# EAGLE design Inyector_fibra_fusibles (EAGLE 9.6.2)
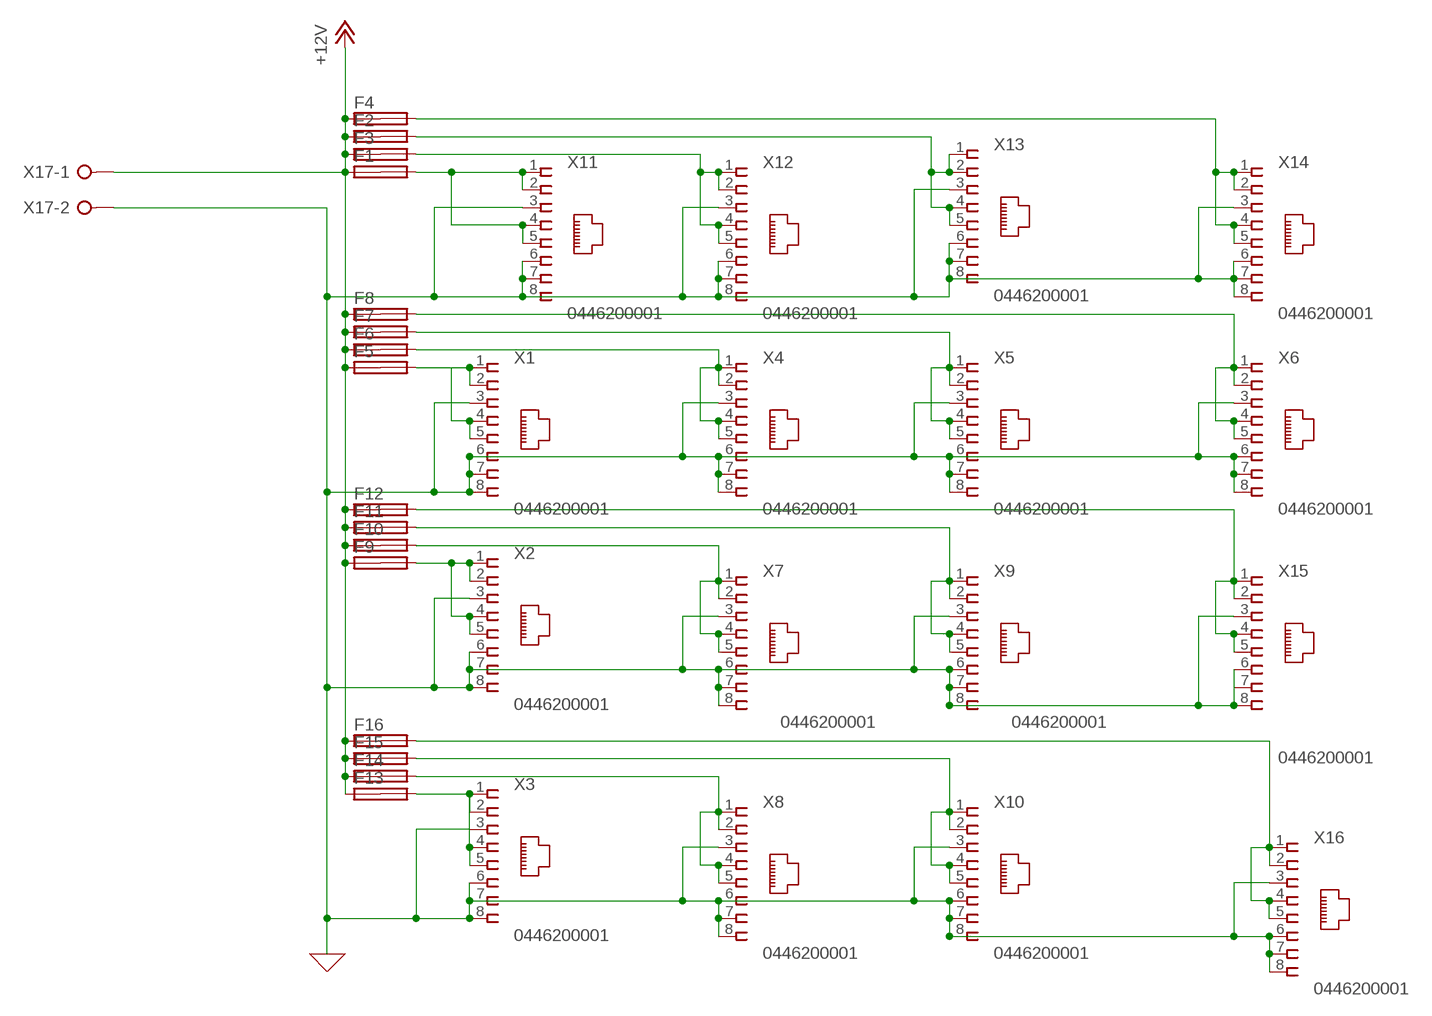
[diagram p0: schematic, sheet 1]

## Parts
F1  SHK20Q  [SHK20Q]
F2  SHK20Q  [SHK20Q]
F3  SHK20Q  [SHK20Q]
F4  SHK20Q  [SHK20Q]
F5  SHK20Q  [SHK20Q]
F6  SHK20Q  [SHK20Q]
F7  SHK20Q  [SHK20Q]
F8  SHK20Q  [SHK20Q]
F9  SHK20Q  [SHK20Q]
F10  SHK20Q  [SHK20Q]
F11  SHK20Q  [SHK20Q]
F12  SHK20Q  [SHK20Q]
F13  SHK20Q  [SHK20Q]
F14  SHK20Q  [SHK20Q]
F15  SHK20Q  [SHK20Q]
F16  SHK20Q  [SHK20Q]
X1  0446200001  [0446200001]
X2  0446200001  [0446200001]
X3  0446200001  [0446200001]
X4  0446200001  [0446200001]
X5  0446200001  [0446200001]
X6  0446200001  [0446200001]
X7  0446200001  [0446200001]
X8  0446200001  [0446200001]
X9  0446200001  [0446200001]
X10  0446200001  [0446200001]
X11  0446200001  [0446200001]
X12  0446200001  [0446200001]
X13  0446200001  [0446200001]
X14  0446200001  [0446200001]
X15  0446200001  [0446200001]
X16  0446200001  [0446200001]
X17  W237-02P  [W237-132]

## Nets
0: X1.3 X1.6 X1.7 X1.8 X2.3 X2.6 X2.7 X2.8 X3.3 X3.6 X3.7 X3.8 X4.3 X4.6 X4.7 X4.8 X5.3 X5.6 X5.7 X5.8 X6.3 X6.6 X6.7 X6.8 X7.3 X7.6 X7.7 X7.8 X8.3 X8.6 X8.7 X8.8 X9.3 X9.6 X9.7 X9.8 X10.3 X10.6 X10.7 X10.8 X11.3 X11.6 X11.7 X11.8 X12.3 X12.6 X12.7 X12.8 X13.3 X13.6 X13.7 X13.8 X14.3 X14.6 X14.7 X14.8 X15.3 X15.6 X15.7 X15.8 X16.3 X16.6 X16.7 X16.8 X17.2 ; supply symbol labelled GND
+12V: F1.1A F2.1A F3.1A F4.1A F5.1A F6.1A F7.1A F8.1A F9.1A F10.1A F11.1A F12.1A F13.1A F14.1A F15.1A F16.1A X17.1
N$1: F12.2A X15.1 X15.2 X15.4 X15.5
N$2: F6.2A X4.1 X4.2 X4.4 X4.5
N$3: F7.2A X5.1 X5.2 X5.4 X5.5
N$4: F1.2A X11.1 X11.2 X11.4 X11.5
N$5: F8.2A X6.1 X6.2 X6.4 X6.5
N$6: F3.2A X12.1 X12.2 X12.4 X12.5
N$7: F2.2A X13.1 X13.2 X13.4 X13.5
N$8: F4.2A X14.1 X14.2 X14.4 X14.5
N$9: F9.2A X2.1 X2.2 X2.4 X2.5
N$12: F5.2A X1.1 X1.2 X1.4 X1.5
N$16: F10.2A X7.1 X7.2 X7.4 X7.5
N$17: F11.2A X9.1 X9.2 X9.4 X9.5
N$18: F13.2A X3.1 X3.2 X3.4 X3.5
N$19: F16.2A X16.1 X16.2 X16.4 X16.5
N$22: F14.2A X8.1 X8.2 X8.4 X8.5
N$24: F15.2A X10.1 X10.2 X10.4 X10.5
Unconnected: F1.1B F1.2B F2.1B F2.2B F3.1B F3.2B F4.1B F4.2B F5.1B F5.2B F6.1B F6.2B F7.1B F7.2B F8.1B F8.2B F9.1B F9.2B F10.1B F10.2B F11.1B F11.2B F12.1B F12.2B F13.1B F13.2B F14.1B F14.2B F15.1B F15.2B F16.1B F16.2B

## Library data of the parts
F1-F16 = fuse:SHK20Q: FUSE HOLDER 5 x 20 mm, SH contact, E1207 Buerklin 64G6061; OC_FARNELL: unknown; OC_NEWARK: unknown
X1-X16 = con-molex:0446200001: RJ-45 INVERTED MODULAR JACK ASSEMBLY WITH RJ-11 KEEPOUT FEATURE Source: Data sheet <http://www.farnell.com/datasheets/73207.pdf>; MF: MOLEX; OC_FARNELL: unknown
X17 = con-wago-508:W237-02P: WAGO SREW CLAMP; OC_FARNELL: unknown; OC_NEWARK: unknown

## Board
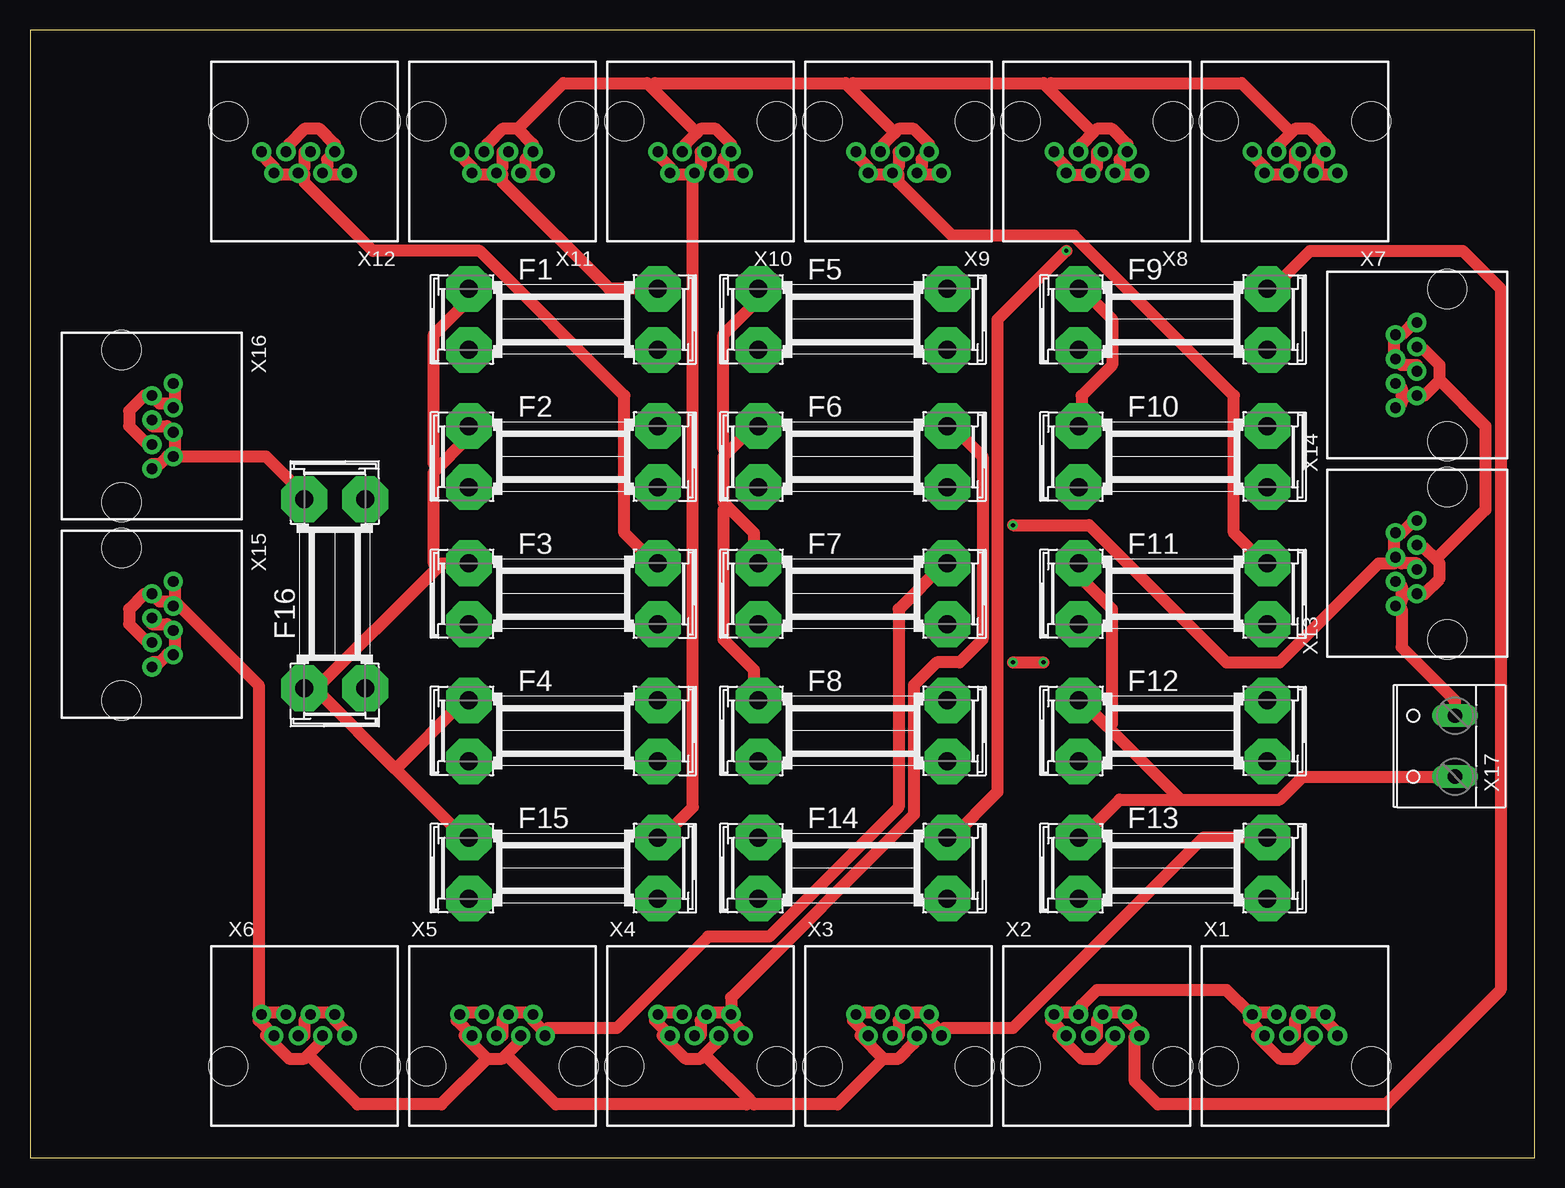
[diagram p1: board, top side]
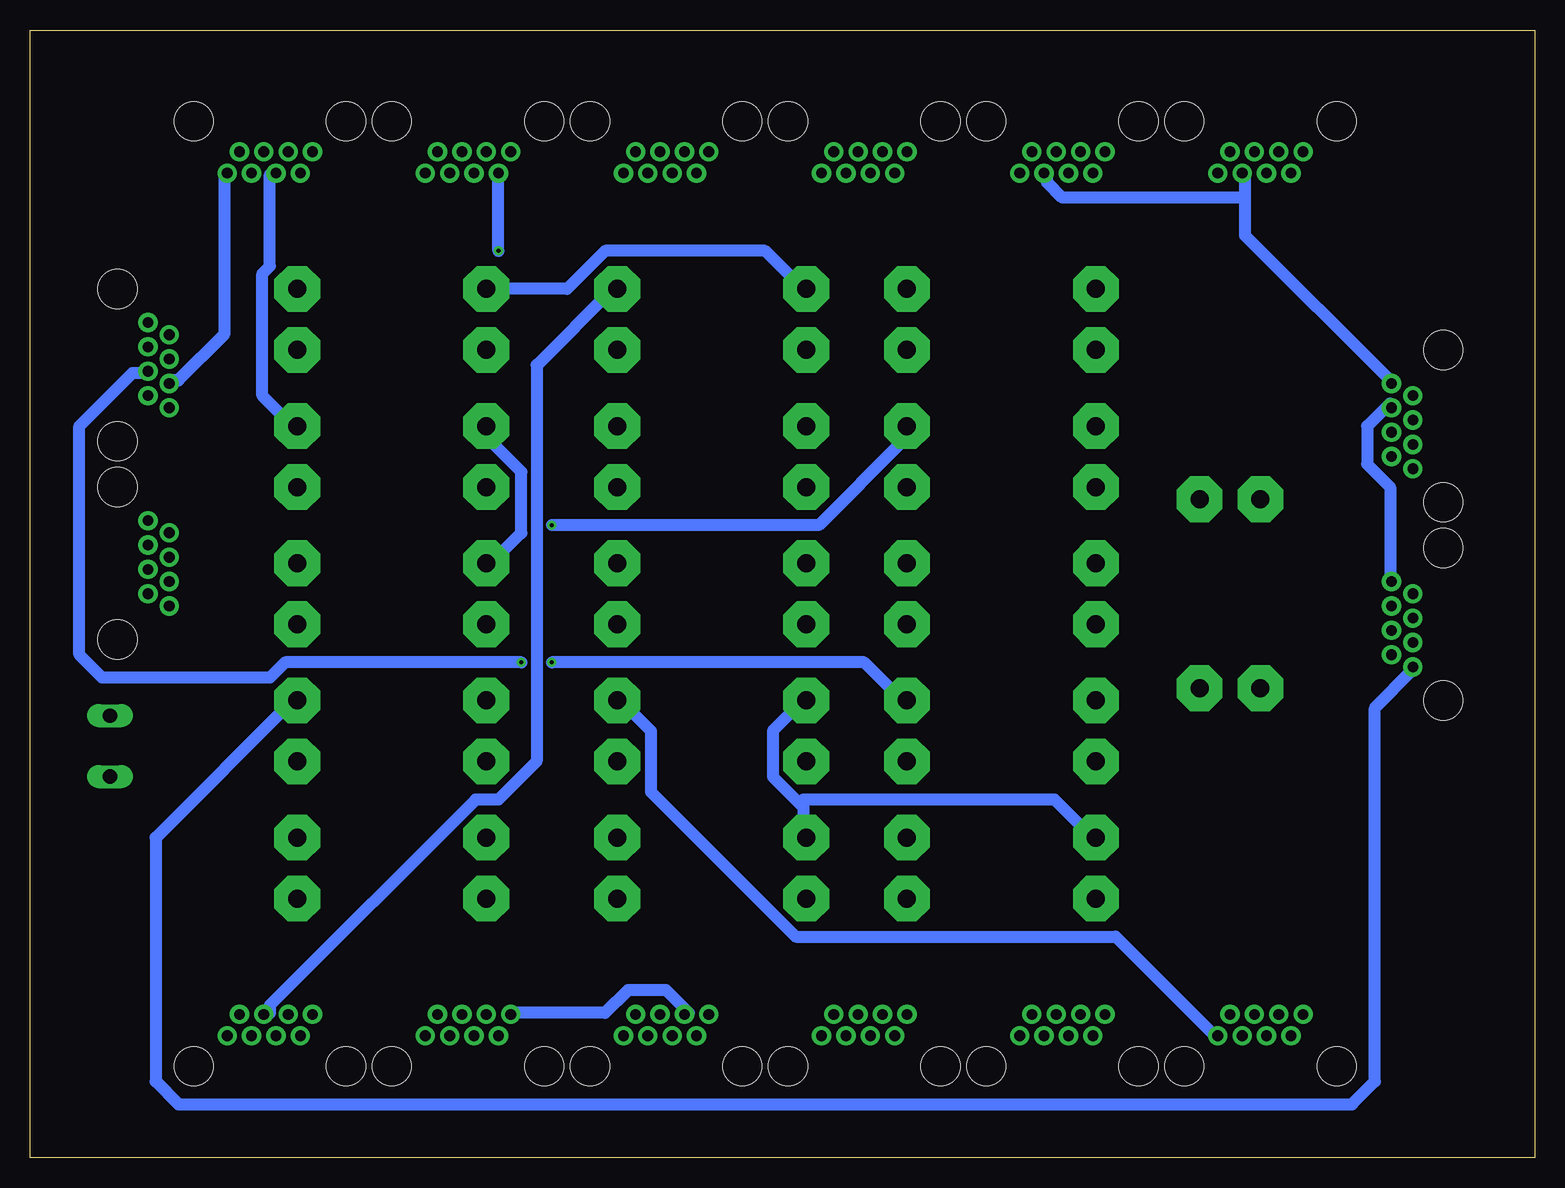
[diagram p2: board, bottom side, seen from below]

Size 125.4 x 93.97 mm. Coordinates in mm from the lower left corner, seen from the top.
Outline: 0,0 125.4,0 125.4,93.97 0,93.97 0,0
Copper layers (1*16): Top 0.035mm / dielectric 1.5mm / Bottom 0.035mm
Design rules "default *": minimum track width 1mm, minimum drill 0.35mm, track to track 6mil, track to pad 6mil, pad to pad 6mil, via to via 6mil, smd to smd 6mil, copper to edge 40mil, drill to drill 6mil, minimum pad ring 14mil, minimum via ring 8mil, stop-mask expansion 4mil, vias tented up to drill 0mil, thermal gap 10mil

### Footprints (pad centres in the part's own frame; a part is rotated, then mirrored left to right if it is on the bottom)
SHK20Q = drill 1.5 pad 3.81 octagon: 1A -7.874,2.54; 1B -7.874,-2.54; 2A 7.874,2.54; 2B 7.874,-2.54
0446200001 = drill 0.889 pad 1.422: 1 3.556,2.54; 2 2.54,4.318; 3 1.524,2.54; 4 0.508,4.318; 5 -0.508,2.54; 6 -1.524,4.318; 7 -2.54,2.54; 8 -3.556,4.318 | hole 3.251: 6.35,0; -6.35,0
W237-132 = drill 1.194 long: 1 -2.54,-0.635; 2 2.54,-0.635

### Placement (x,y rotation side)
F1  44.45,69.85 0 top
F2  44.45,58.42 0 top
F3  44.45,46.99 0 top
F4  44.45,35.56 0 top
F5  68.58,69.85 0 top
F6  68.58,58.42 0 top
F7  68.58,46.99 0 top
F8  68.58,35.56 0 top
F9  95.25,69.85 0 top
F10  95.25,58.42 0 top
F11  95.25,46.99 0 top
F12  95.25,35.56 0 top
F13  95.25,24.13 0 top
F14  68.58,24.13 0 top
F15  44.45,24.13 0 top
F16  25.4,46.99 90 top
X1  105.41,7.62 0 top
X2  88.9,7.62 0 top
X3  72.39,7.62 0 top
X4  55.88,7.62 0 top
X5  39.37,7.62 0 top
X6  22.86,7.62 0 top
X7  105.41,86.36 180 top
X8  88.9,86.36 180 top
X9  72.39,86.36 180 top
X10  55.88,86.36 180 top
X11  39.37,86.36 180 top
X12  22.86,86.36 180 top
X13  118.11,49.53 90 top
X14  118.11,66.04 90 top
X15  7.62,44.45 270 top
X16  7.62,60.96 270 top
X17  118.11,34.29 90 top

### Tracks (layer width: path | path; a pad name or v marks a point on that pad's centre or on a via)
0
  Top 1: X6.8 19.69,12.06 20.95,12.06 X6.6 | X6.8 19.05,11.43 X6.7 19.69,10.16 21.59,8.26 22.86,8.26 23.18,8.57 | 23.18,8.57 24.13,9.53 24.13,10.16 X6.3 | X5.6 37.47,12.06 36.2,12.06 X5.8 35.56,11.43 X5.7 36.2,10.16 38.1,8.26 | 39.69,8.57 39.37,8.26 38.1,8.26 | 39.69,8.57 40.64,9.53 40.64,10.16 X5.3 | 23.18,8.57 27.3,4.45 34.29,4.45 38.1,8.26 | X2.3 90.17,10.16 90.17,9.53 88.9,8.26 87.63,8.26 85.72,10.16 X2.7 85.09,11.43 X2.8 85.72,12.06 86.99,12.06 X2.6 87.63,12.06 87.63,12.7 88.9,13.97 99.69,13.97 101.6,12.06 X1.8 | X1.8 102.23,12.06 103.5,12.06 X1.6 | X1.8 101.6,11.43 X1.7 102.23,10.16 104.14,8.26 105.41,8.26 106.68,9.53 106.68,10.16 X1.3 | X4.6 53.97,12.06 52.7,12.06 X4.8 52.07,11.43 X4.7 52.7,10.16 54.61,8.26 55.88,8.26 56.2,8.57 | 56.2,8.57 57.15,9.53 57.15,10.16 X4.3 | X3.6 70.48,12.06 69.22,12.06 X3.8 68.58,11.43 X3.7 69.22,10.16 71.12,8.26 | 71.12,8.26 72.39,8.26 73.66,9.53 73.66,10.16 X3.3 | 60.01,4.76 60.33,4.45 67.31,4.45 71.12,8.26 | 60.01,4.76 56.2,8.57 | 39.69,8.57 43.81,4.45 59.69,4.45 60.01,4.76 | 114.3,46.99 114.3,47.62 X13.6 | 114.3,46.99 114.3,46.36 X13.8 114.3,45.72 114.3,42.55 118.74,38.1 X17.2 | 114.3,46.99 X13.7 116.2,46.99 117.47,48.26 117.47,49.53 117.16,49.85 | 117.16,49.85 116.2,50.8 115.57,50.8 X13.3 | 114.3,63.5 114.3,64.14 X14.6 | 114.3,63.5 114.3,62.86 X14.8 | 114.3,63.5 X14.7 116.2,63.5 117.47,64.77 | 117.47,64.77 117.47,66.04 116.2,67.31 115.57,67.31 X14.3 | X7.8 108.58,81.91 107.31,81.91 X7.6 107.31,82.55 107.31,83.19 X7.7 107.95,84.45 106.68,85.72 105.41,85.72 105.09,85.41 | 105.09,85.41 104.14,84.45 104.14,83.82 X7.3 | 117.16,49.85 121.28,53.97 121.28,60.96 117.47,64.77
  Top 1: X8.8 92.08,81.91 90.8,81.91 X8.6 90.8,82.55 90.8,83.19 X8.7 91.44,84.45 90.17,85.72 88.9,85.72 88.58,85.41 | 88.58,85.41 87.63,84.45 87.63,83.82 X8.3 | X9.8 75.56,81.91 74.3,81.91 X9.6 74.3,82.55 74.3,83.19 X9.7 74.93,84.45 73.66,85.72 72.39,85.72 72.07,85.41 | 72.07,85.41 71.12,84.45 71.12,83.82 X9.3 | X10.8 59.06,81.91 57.78,81.91 X10.6 57.78,82.55 57.78,83.19 X10.7 58.42,84.45 57.15,85.72 55.88,85.72 55.56,85.41 | 55.56,85.41 54.61,84.45 54.61,83.82 X10.3 | X11.8 42.55,81.91 41.27,81.91 X11.6 41.27,82.55 41.27,83.19 X11.7 41.91,84.45 40.64,85.72 | 40.64,85.72 39.37,85.72 38.1,84.45 38.1,83.82 X11.3 | X12.8 26.04,81.91 24.77,81.91 X12.6 24.77,82.55 24.77,83.19 X12.7 25.4,84.45 24.13,85.72 22.86,85.72 21.59,84.45 21.59,83.82 X12.3 | 12.06,46.36 12.06,47.62 X15.8 | X15.3 10.16,43.18 9.53,43.18 8.26,44.45 8.26,45.72 9.53,46.99 X15.7 10.79,46.36 11.43,46.36 X15.6 12.06,46.36 | X16.8 12.06,64.14 12.06,62.86 X16.6 11.43,62.86 10.79,62.86 X16.7 9.53,63.5 8.26,62.23 8.26,60.96 9.53,59.69 10.16,59.69 X16.3 | 51.75,89.22 51.44,89.53 44.45,89.53 40.64,85.72 | 51.75,89.22 55.56,85.41 | 68.26,89.22 67.94,89.53 52.07,89.53 51.75,89.22 | 68.26,89.22 72.07,85.41 | 84.77,89.22 84.45,89.53 68.58,89.53 68.26,89.22 | 84.77,89.22 88.58,85.41 | 105.09,85.41 100.97,89.53 85.09,89.53 84.77,89.22 | 12.06,46.36 19.05,39.37 19.05,12.06 X6.8
  Bottom 1: X2.8 85.09,12.06 77.47,12.06 75.56,13.97 72.39,13.97 70.48,12.06 X3.6 | X14.6 113.66,64.77 113.03,64.77 109.22,68.58 109.22,81.91 X7.8 | X15.8 12.06,48.26 12.06,55.88 13.97,57.78 13.97,60.96 12.06,62.86 X16.6 | 24.13,80.01 24.13,76.83 12.06,64.77 X16.8 | 24.13,80.01 24.13,81.91 X12.6 | 24.13,80.01 39.37,80.01 40.64,81.28 40.64,81.91 X11.6
+12V
  Top 1: F10.1A 87.63,60.96 87.63,63.5 90.17,66.04 90.17,69.85 87.63,72.39 F9.1A | X17.1 106.05,31.75 104.14,29.84 95.88,29.84 | 95.88,29.84 90.8,29.84 87.63,26.67 F13.1A | 95.88,29.84 89.85,35.88 | 89.85,35.88 87.63,38.1 F12.1A | F11.1A 87.63,49.53 87.63,48.26 90.17,45.72 90.17,36.2 89.85,35.88 | 58.1,54.29 57.78,54.61 57.78,58.42 58.1,58.74 | 58.1,54.29 60.33,52.07 60.33,49.53 F7.1A | 58.1,58.74 60.33,60.96 F6.1A | F5.1A 60.33,72.39 60.33,71.12 57.78,68.58 57.78,59.06 58.1,58.74 | F8.1A 60.33,38.1 60.33,40.64 57.78,43.18 57.78,53.97 58.1,54.29 | 23.5,38.73 24.13,38.73 30.48,32.39 | 23.5,38.73 22.86,38.73 F16.1A 23.5,38.73 | 30.48,32.39 36.2,26.67 F15.1A | 30.48,32.39 36.2,38.1 F4.1A | F3.1A 34.29,49.53 33.97,49.21 | 23.5,38.73 33.97,49.21 | 33.97,57.47 33.66,57.15 33.66,49.53 33.97,49.21 | 33.97,57.47 36.2,59.69 36.2,60.96 F2.1A | F1.1A 36.2,72.39 36.2,71.12 33.66,68.58 33.66,57.78 33.97,57.47
  Bottom 1: F10.1A 86.99,60.96 86.99,59.69 84.45,57.15 84.45,52.07 86.99,49.53 F11.1A | 61.28,29.53 63.5,31.75 63.5,35.56 60.96,38.1 F8.1A | 61.28,29.53 60.96,29.21 60.96,26.67 F14.1A | 61.28,29.53 60.96,29.84 40,29.84 36.83,26.67 F15.1A | F9.1A 80.64,72.39 77.47,75.56 64.14,75.56 60.96,72.39 F5.1A
N$1
  Top 1: X15.1 10.16,41.27 10.79,41.27 11.43,41.91 X15.2 12.06,41.91 12.06,43.81 X15.4 11.43,44.45 10.16,44.45 X15.5
  Bottom 1: X15.1 10.16,40.64 13.34,37.47 13.34,6.35 15.24,4.45 113.03,4.45 114.94,6.35 114.94,26.67 103.5,38.1 F12.2A
N$2
  Top 1: X4.5 55.88,10.16 55.88,11.43 X4.4 56.52,12.06 58.42,12.06 | X4.1 59.69,10.16 58.42,11.43 X4.2 58.42,12.06 | 58.42,12.06 58.42,13.34 73.66,28.57 73.66,39.37 75.56,41.27 77.47,41.27 79.38,43.18 79.38,58.42 76.83,60.96 F6.2A
N$3
  Top 1: X5.5 39.37,10.16 39.37,11.43 X5.4 40,12.06 41.91,12.06 X5.2 41.91,11.43 43.18,10.16 X5.1 43.18,10.79 48.89,10.79 56.52,18.41 61.59,18.41 72.39,29.21 72.39,45.72 76.2,49.53 F7.2A
N$4
  Top 1: X11.1 35.56,83.82 36.83,82.55 X11.2 36.83,81.91 38.73,81.91 X11.4 | X11.4 39.37,82.55 39.37,83.82 X11.5 | F1.2A 48.26,72.39 39.37,81.28 39.37,81.91 X11.4
N$5
  Top 1: X6.5 22.86,10.16 22.86,11.43 X6.4 23.5,12.06 25.4,12.06 X6.2 25.4,11.43 26.67,10.16 X6.1
  Bottom 1: X6.1 26.67,10.16 34.92,18.41 61.59,18.41 73.66,30.48 73.66,35.56 76.2,38.1 F8.2A
N$6
  Top 1: X12.1 19.05,83.82 20.32,82.55 X12.2 20.32,81.91 22.23,81.91 X12.4 | X12.4 22.86,82.55 22.86,83.82 X12.5 | X12.4 22.86,81.91 22.86,81.28 28.57,75.56 37.47,75.56 49.53,63.5 49.53,52.07 52.07,49.53 F3.2A
N$7  (via drill 0.35)
  Top 1: X13.4 114.3,49.53 115.57,49.53 X13.5 | X13.1 115.57,53.34 114.3,52.07 X13.2 113.66,52.07 113.66,50.17 X13.4 | v81.91,52.7 88.27,52.7 99.69,41.27 104.14,41.27 112.39,49.53 113.66,49.53 X13.4
  Bottom 1: v81.91,52.7 59.69,52.7 52.7,59.69 52.7,60.96 F2.2A
N$8  (via drill 0.35)
  Top 1: X14.5 115.57,66.04 114.3,66.04 X14.4 113.66,66.67 113.66,68.58 X14.2 114.3,68.58 115.57,69.85 X14.1 | v81.91,41.27 v84.45,41.27
  Bottom 1: v84.45,41.27 104.14,41.27 105.41,40 119.38,40 121.28,41.91 121.28,60.96 116.84,65.41 115.57,65.41 X14.5 | v81.91,41.27 55.88,41.27 52.7,38.1 F4.2A
N$9
  Top 1: X2.5 88.9,10.16 88.9,11.43 X2.4 89.53,12.06 91.44,12.06 X2.2 91.44,11.43 92.71,10.16 X2.1 92.08,10.16 92.08,6.35 93.98,4.45 113.03,4.45 122.55,13.97 122.55,72.39 119.38,75.56 106.68,75.56 103.5,72.39 F9.2A
N$12
  Top 1: X1.5 105.41,10.16 105.41,11.43 X1.4 106.05,12.06 107.95,12.06 X1.2 107.95,11.43 109.22,10.16 X1.1
  Bottom 1: X1.4 105.41,12.06 105.41,12.7 88.27,29.84 86.36,29.84 83.19,33.02 83.19,66.04 76.83,72.39 F5.2A
N$16
  Top 1: X7.1 101.6,83.82 102.87,82.55 X7.2 102.87,81.91 104.77,81.91 X7.4 105.41,82.55 105.41,83.82 X7.5
  Bottom 1: X7.4 105.41,81.91 105.41,74.3 106.05,73.66 106.05,63.5 103.5,60.96 F10.2A
N$17
  Top 1: X9.1 68.58,83.82 69.85,82.55 X9.2 69.85,81.91 71.75,81.91 X9.4 | X9.4 72.39,82.55 72.39,83.82 X9.5 | X9.4 72.39,81.91 72.39,81.28 76.83,76.83 86.99,76.83 100.33,63.5 100.33,52.07 102.87,49.53 F11.2A
N$18
  Top 1: X3.5 72.39,10.16 72.39,11.43 X3.4 73.03,12.06 74.93,12.06 X3.2 74.93,11.43 76.2,10.16 X3.1 76.2,10.79 81.91,10.79 97.79,26.67 F13.2A
N$19
  Top 1: X16.1 10.16,57.78 10.79,57.78 11.43,58.42 X16.2 12.06,58.42 | X16.5 10.16,60.96 11.43,60.96 X16.4 12.06,60.33 12.06,58.42 | 12.06,58.42 19.69,58.42 22.86,55.25 F16.2A
N$22  (via drill 0.35)
  Top 1: X8.5 88.9,83.82 88.9,82.55 X8.4 88.27,81.91 86.36,81.91 X8.2 86.36,82.55 85.09,83.82 X8.1 | v86.36,75.56 80.64,69.85 80.64,30.48 76.83,26.67 F14.2A
  Bottom 1: 89.57,83.91 X8.5 | v86.36,75.56 X8.2
N$24
  Top 1: X10.1 52.07,83.82 53.34,82.55 X10.2 53.34,81.91 55.25,81.91 | X10.5 55.88,83.82 55.88,82.55 X10.4 55.25,81.91 | 55.25,81.91 55.25,29.21 52.7,26.67 F15.2A